# Altium project MB.PrjPCB
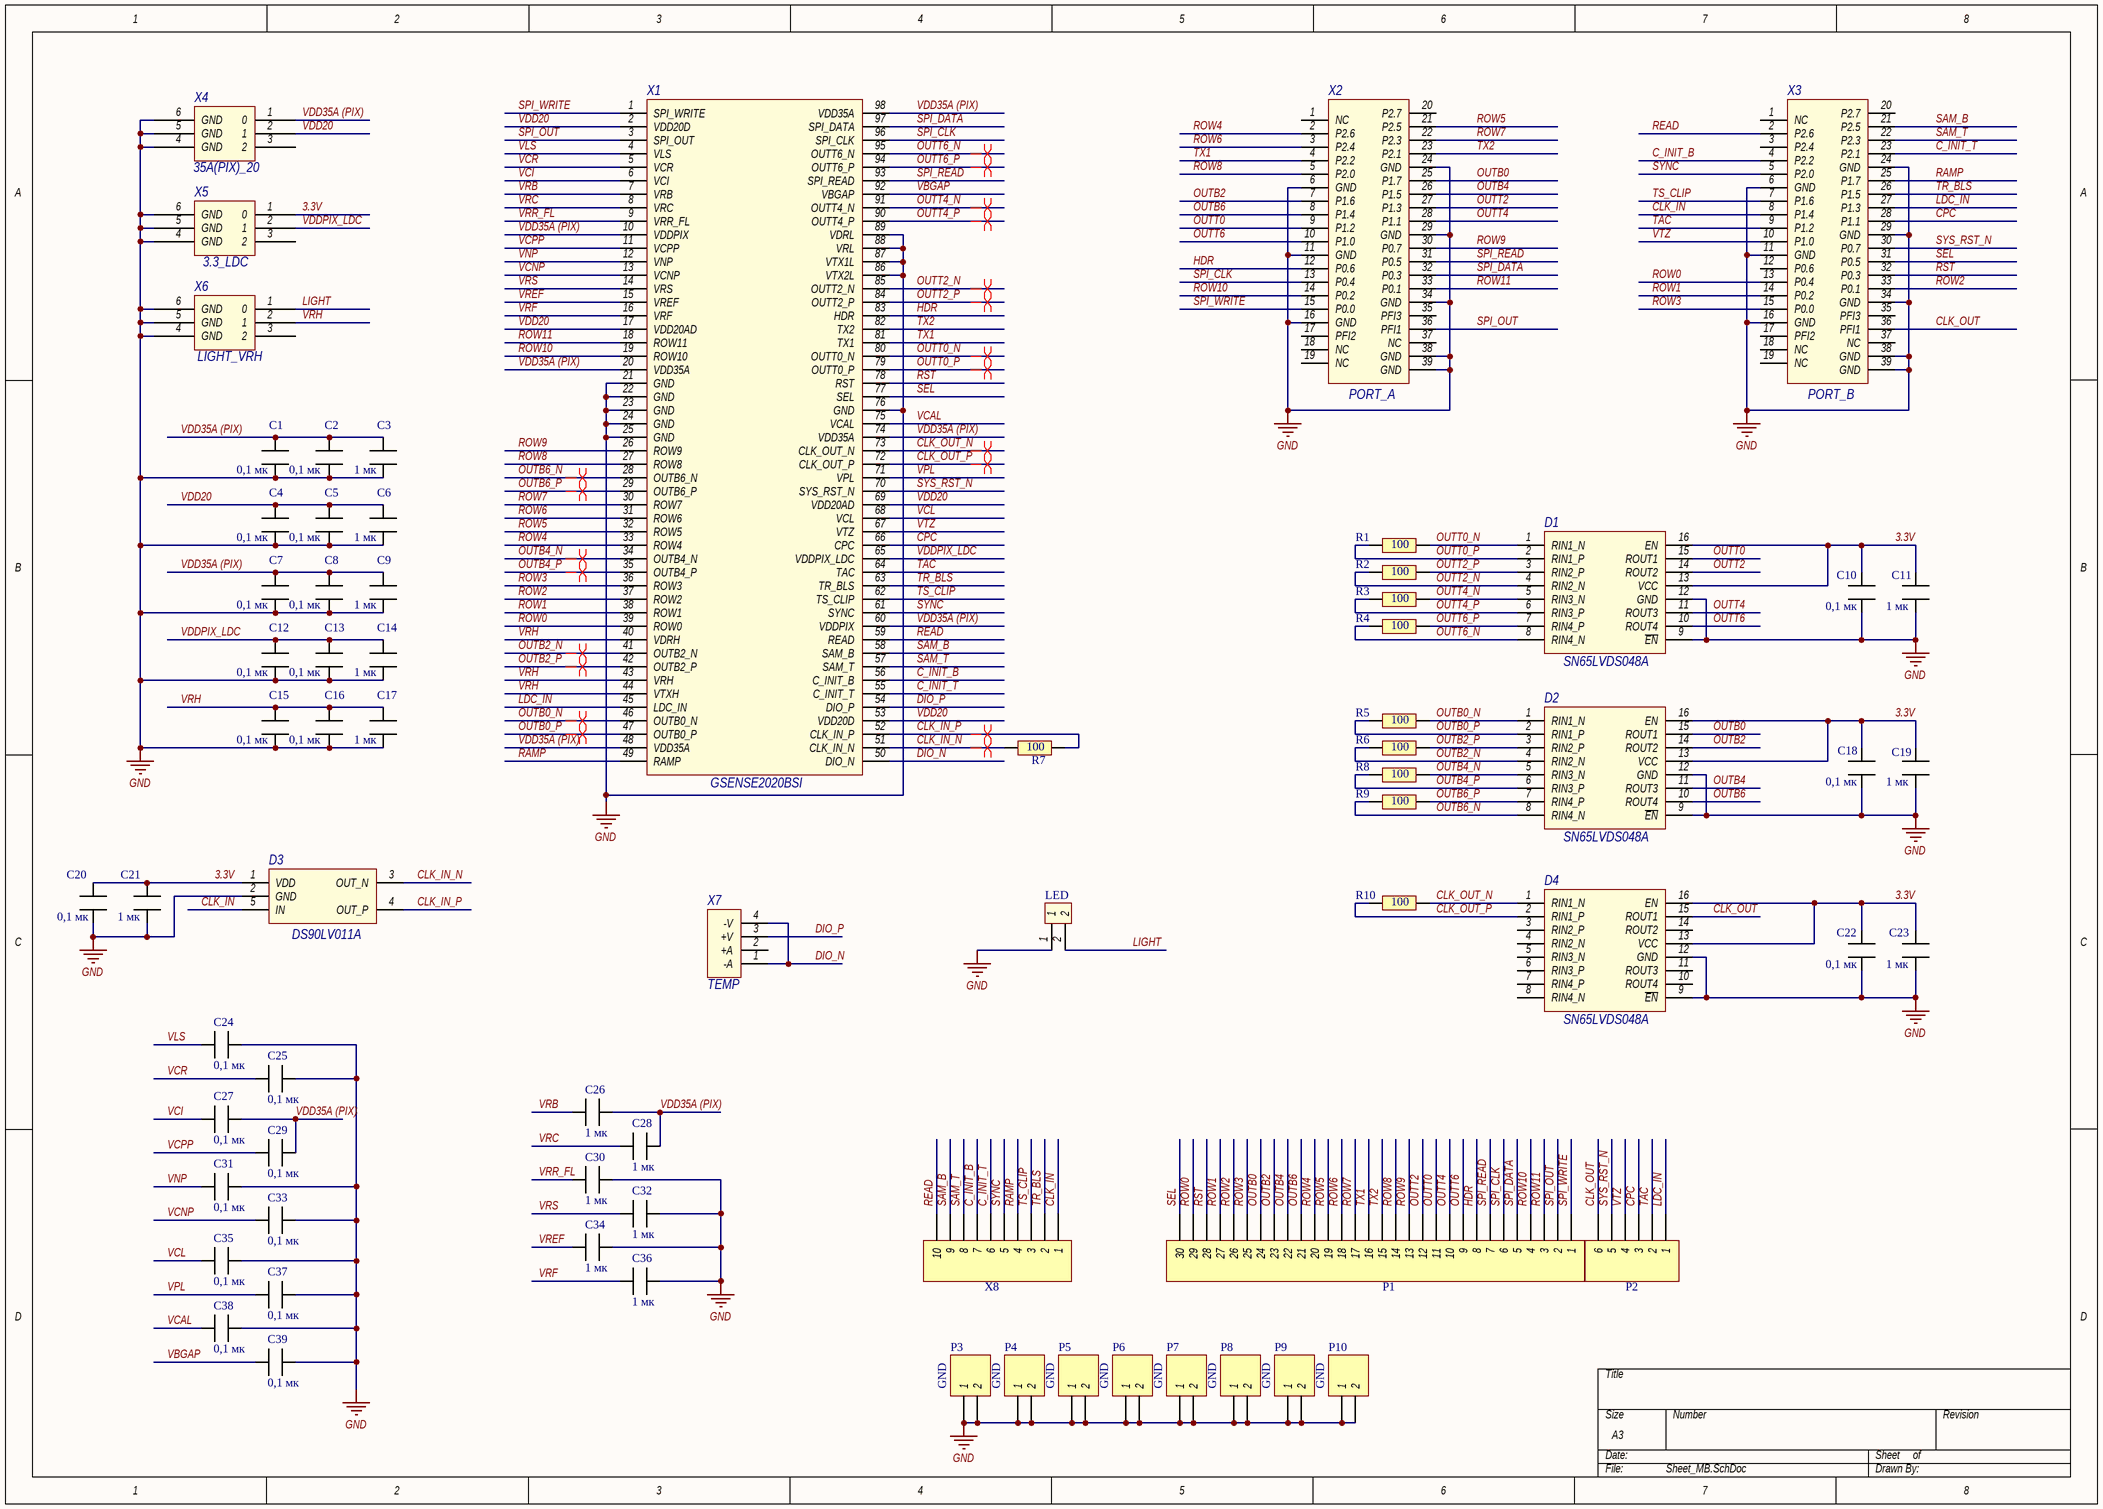
[diagram p0: Sheet_MB.SchDoc]
1 sheet, 72 parts. Net scope: global (net labels, ports and power ports of the same name join across sheets).
Board file: PCB_MB.PcbDoc

## Sheet Sheet_MB.SchDoc
size A3

### Parts
C1  0,1 мк  [CAP_SMALL]
C2  0,1 мк  [CAP_SMALL]
C3  1 мк  [CAP_SMALL]
C4  0,1 мк  [CAP_SMALL]
C5  0,1 мк  [CAP_SMALL]
C6  1 мк  [CAP_SMALL]
C7  0,1 мк  [CAP_SMALL]
C8  0,1 мк  [CAP_SMALL]
C9  1 мк  [CAP_SMALL]
C10  0,1 мк  [CAP_SMALL]
C11  1 мк  [CAP_SMALL]
C12  0,1 мк  [CAP_SMALL]
C13  0,1 мк  [CAP_SMALL]
C14  1 мк  [CAP_SMALL]
C15  0,1 мк  [CAP_SMALL]
C16  0,1 мк  [CAP_SMALL]
C17  1 мк  [CAP_SMALL]
C18  0,1 мк  [CAP_SMALL]
C19  1 мк  [CAP_SMALL]
C20  0,1 мк  [CAP_SMALL]
C21  1 мк  [CAP_SMALL]
C22  0,1 мк  [CAP_SMALL]
C23  1 мк  [CAP_SMALL]
C24  0,1 мк  [CAP_SMALL]
C25  0,1 мк  [CAP_SMALL]
C26  1 мк  [CAP_SMALL]
C27  0,1 мк  [CAP_SMALL]
C28  1 мк  [CAP_SMALL]
C29  0,1 мк  [CAP_SMALL]
C30  1 мк  [CAP_SMALL]
C31  0,1 мк  [CAP_SMALL]
C32  1 мк  [CAP_SMALL]
C33  0,1 мк  [CAP_SMALL]
C34  1 мк  [CAP_SMALL]
C35  0,1 мк  [CAP_SMALL]
C36  1 мк  [CAP_SMALL]
C37  0,1 мк  [CAP_SMALL]
C38  0,1 мк  [CAP_SMALL]
C39  0,1 мк  [CAP_SMALL]
D1  SN65LVDS048A  [SN65LVDS048A (4LVDS)]
D2  SN65LVDS048A  [SN65LVDS048A (4LVDS)]
D3  DS90LV011A  [DS90LV011A]
D4  SN65LVDS048A  [SN65LVDS048A (4LVDS)]
LED  LED  [KLEMMNIK_2]  (value not drawn)
P1  Header 30  [HDR1X30]  (value not drawn)
P2  Header 6  [HDR1X6]  (value not drawn)
P3  GND  [HDR1X2]
P4  GND  [HDR1X2]
P5  GND  [HDR1X2]
P6  GND  [HDR1X2]
P7  GND  [HDR1X2]
P8  GND  [HDR1X2]
P9  GND  [HDR1X2]
P10  GND  [HDR1X2]
R1  100  [RES]
R2  100  [RES]
R3  100  [RES]
R4  100  [RES]
R5  100  [RES]
R6  100  [RES]
R7  100  [RES]
R8  100  [RES]
R9  100  [RES]
R10  100  [RES]
X1  GSENSE2020BSI  [GSENSE2020BSI_MEZ]
X2  PORT_A  [CHEAP_CONN_FEMALE]
X3  PORT_B  [CHEAP_CONN_FEMALE]
X4  35A(PIX)_20  [POWER]
X5  3.3_LDC  [POWER]
X6  LIGHT_VRH  [POWER]
X7  TEMP  [AMP_VOLTMETER]
X8  Header 10  [HDR1X10]  (value not drawn)

### Nets
GND: C1.1 C2.1 C3.1 C4.1 C5.1 C6.1 C7.1 C8.1 C9.1 C10.1 C11.1 C12.1 C13.1 C14.1 C15.1 C16.1 C17.1 C18.1 C19.1 C20.1 C21.1 C22.1 C23.1 C24.1 C25.1 C30.1 C31.1 C32.1 C33.1 C34.1 C35.1 C36.1 C37.1 C38.1 C39.1 D1.9(~{EN}) D1.12(GND) D2.9(~{EN}) D2.12(GND) D3.2(GND) D4.9(~{EN}) D4.12(GND) LED.1 P3.1 P3.2 P4.1 P4.2 P5.1 P5.2 P6.1 P6.2 P7.1 P7.2 P8.1 P8.2 P9.1 P9.2 P10.1 P10.2 X1.21(GND) X1.22(GND) X1.23(GND) X1.24(GND) X1.25(GND) X1.76(GND) X1.86(VTX2L) X1.87(VTX1L) X1.88(VRL) X1.89(VDRL) X2.6(GND) X2.11(GND) X2.16(GND) X2.24(GND) X2.29(GND) X2.34(GND) X2.38(GND) X2.39(GND) X3.6(GND) X3.11(GND) X3.16(GND) X3.24(GND) X3.29(GND) X3.34(GND) X3.38(GND) X3.39(GND) X4.4(GND) X4.5(GND) X4.6(GND) X5.4(GND) X5.5(GND) X5.6(GND) X6.4(GND) X6.5(GND) X6.6(GND)
3.3V: C10.2 C11.2 C18.2 C19.2 C20.2 C21.2 C22.2 C23.2 D1.13(VCC) D1.16(EN) D2.13(VCC) D2.16(EN) D3.1(VDD) D4.13(VCC) D4.16(EN) X5.1(0)
C_INIT_B: X1.56(C_INIT_B) X3.4(P2.2) X8.7
C_INIT_T: X1.55(C_INIT_T) X3.23(P2.1) X8.6
CLK_IN: D3.5(IN) X3.8(P1.4) X8.1
CLK_IN_N: D3.3(OUT_N) R7.1 X1.51(CLK_IN_N)
CLK_IN_P: D3.4(OUT_P) R7.2 X1.52(CLK_IN_P)
CLK_OUT: D4.15(ROUT1) P2.6 X3.36(PFI1)
CLK_OUT_N: D4.1(RIN1_N) R10.2 X1.73(CLK_OUT_N)
CLK_OUT_P: D4.2(RIN1_P) R10.1 X1.72(CLK_OUT_P)
CPC: P2.3 X1.66(CPC) X3.28(P1.1)
DIO_N: X1.50(DIO_N) X7.1(-A) X7.4(-V)
DIO_P: X1.54(DIO_P) X7.3(+V)
HDR: P1.8 X1.83(HDR) X2.12(P0.6)
LDC_IN: P2.1 X1.45(LDC_IN) X3.27(P1.3)
LIGHT: LED.2 X6.1(0)
OUTB0: D2.15(ROUT1) P1.24 X2.25(P1.7)
OUTB0_N: D2.1(RIN1_N) R5.2 X1.46(OUTB0_N)
OUTB0_P: D2.2(RIN1_P) R5.1 X1.47(OUTB0_P)
OUTB2: D2.14(ROUT2) P1.23 X2.7(P1.6)
OUTB2_N: D2.4(RIN2_N) R6.1 X1.41(OUTB2_N)
OUTB2_P: D2.3(RIN2_P) R6.2 X1.42(OUTB2_P)
OUTB4: D2.11(ROUT3) P1.22 X2.26(P1.5)
OUTB4_N: D2.5(RIN3_N) R8.2 X1.34(OUTB4_N)
OUTB4_P: D2.6(RIN3_P) R8.1 X1.35(OUTB4_P)
OUTB6: D2.10(ROUT4) P1.21 X2.8(P1.4)
OUTB6_N: D2.8(RIN4_N) R9.1 X1.28(OUTB6_N)
OUTB6_P: D2.7(RIN4_P) R9.2 X1.29(OUTB6_P)
OUTT0: D1.15(ROUT1) P1.11 X2.9(P1.2)
OUTT0_N: D1.1(RIN1_N) R1.2 X1.80(OUTT0_N)
OUTT0_P: D1.2(RIN1_P) R1.1 X1.79(OUTT0_P)
OUTT2: D1.14(ROUT2) P1.12 X2.27(P1.3)
OUTT2_N: D1.4(RIN2_N) R2.1 X1.85(OUTT2_N)
OUTT2_P: D1.3(RIN2_P) R2.2 X1.84(OUTT2_P)
OUTT4: D1.11(ROUT3) P1.10 X2.28(P1.1)
OUTT4_N: D1.5(RIN3_N) R3.2 X1.91(OUTT4_N)
OUTT4_P: D1.6(RIN3_P) R3.1 X1.90(OUTT4_P)
OUTT6: D1.10(ROUT4) P1.9 X2.10(P1.0)
OUTT6_N: D1.8(RIN4_N) R4.1 X1.95(OUTT6_N)
OUTT6_P: D1.7(RIN4_P) R4.2 X1.94(OUTT6_P)
RAMP: X1.49(RAMP) X3.25(P1.7) X8.4
READ: X1.59(READ) X3.2(P2.6) X8.10
ROW0: P1.29 X1.39(ROW0) X3.13(P0.4)
ROW1: P1.27 X1.38(ROW1) X3.14(P0.2)
ROW2: P1.26 X1.37(ROW2) X3.33(P0.1)
ROW3: P1.25 X1.36(ROW3) X3.15(P0.0)
ROW4: P1.20 X1.33(ROW4) X2.2(P2.6)
ROW5: P1.19 X1.32(ROW5) X2.21(P2.5)
ROW6: P1.18 X1.31(ROW6) X2.3(P2.4)
ROW7: P1.17 X1.30(ROW7) X2.22(P2.3)
ROW8: P1.14 X1.27(ROW8) X2.5(P2.0)
ROW9: P1.13 X1.26(ROW9) X2.30(P0.7)
ROW10: P1.4 X1.19(ROW10) X2.14(P0.2)
ROW11: P1.3 X1.18(ROW11) X2.33(P0.1)
RST: P1.28 X1.78(RST) X3.32(P0.3)
SAM_B: X1.58(SAM_B) X3.21(P2.5) X8.9
SAM_T: X1.57(SAM_T) X3.22(P2.3) X8.8
SEL: P1.30 X1.77(SEL) X3.31(P0.5)
SPI_CLK: P1.6 X1.96(SPI_CLK) X2.13(P0.4)
SPI_DATA: P1.5 X1.97(SPI_DATA) X2.32(P0.3)
SPI_OUT: P1.2 X1.3(SPI_OUT) X2.36(PFI1)
SPI_READ: P1.7 X1.93(SPI_READ) X2.31(P0.5)
SPI_WRITE: P1.1 X1.1(SPI_WRITE) X2.15(P0.0)
SYNC: X1.61(SYNC) X3.5(P2.0) X8.5
SYS_RST_N: P2.5 X1.70(SYS_RST_N) X3.30(P0.7)
TAC: P2.2 X1.64(TAC) X3.9(P1.2)
TR_BLS: X1.63(TR_BLS) X3.26(P1.5) X8.2
TS_CLIP: X1.62(TS_CLIP) X3.7(P1.6) X8.3
TX1: P1.16 X1.81(TX1) X2.4(P2.2)
TX2: P1.15 X1.82(TX2) X2.23(P2.1)
VBGAP: C39.2 X1.92(VBGAP)
VCAL: C38.2 X1.75(VCAL)
VCI: C27.2 X1.6(VCI)
VCL: C35.2 X1.68(VCL)
VCNP: C33.2 X1.13(VCNP)
VCPP: C29.2 X1.11(VCPP)
VCR: C25.2 X1.5(VCR)
VDD20: C4.2 C5.2 C6.2 X1.2(VDD20D) X1.17(VDD20AD) X1.53(VDD20D) X1.69(VDD20AD) X4.2(1)
VDD35A (PIX): C1.2 C2.2 C3.2 C7.2 C8.2 C9.2 C26.1 C27.1 C28.1 C29.1 X1.10(VDDPIX) X1.20(VDD35A) X1.48(VDD35A) X1.60(VDDPIX) X1.74(VDD35A) X1.98(VDD35A) X4.1(0)
VDDPIX_LDC: C12.2 C13.2 C14.2 X1.65(VDDPIX_LDC) X5.2(1)
VLS: C24.2 X1.4(VLS)
VNP: C31.2 X1.12(VNP)
VPL: C37.2 X1.71(VPL)
VRB: C26.2 X1.7(VRB)
VRC: C28.2 X1.8(VRC)
VREF: C34.2 X1.15(VREF)
VRF: C36.2 X1.16(VRF)
VRH: C15.2 C16.2 C17.2 X1.40(VDRH) X1.43(VRH) X1.44(VTXH) X6.2(1)
VRR_FL: C30.2 X1.9(VRR_FL)
VRS: C32.2 X1.14(VRS)
VTZ: P2.4 X1.67(VTZ) X3.10(P1.0)

Not connected (* = marked no-connect by the designer): D4 3(RIN2_P) 4(RIN2_N) 5(RIN3_N) 6(RIN3_P) 7(RIN4_P) 8(RIN4_N) 10(ROUT4) 11(ROUT3) 14(ROUT2); X2 1(NC) 17(PFI2) 18(NC) 19(NC) 20(P2.7) 35(PFI3) 37(NC); X3 1(NC) 3(P2.4) 12(P0.6) 17(PFI2) 18(NC) 19(NC) 20(P2.7) 35(PFI3) 37(NC); X4 3(2); X5 3(2); X6 3(2); X7 2(+A)

### Layout directives
differential pair: CLK_IN_N, CLK_IN_P, CLK_OUT_N, CLK_OUT_P, OUTB0_N, OUTB0_P, OUTB2_N, OUTB2_P, OUTB4_N, OUTB4_P, OUTB6_N, OUTB6_P, OUTT0_N, OUTT0_P, OUTT2_N, OUTT2_P, OUTT4_N, OUTT4_P, OUTT6_N, OUTT6_P

### Library data of the parts
C1-C39 = CAP_SMALL
D1 D2 D4 = SN65LVDS048A (4LVDS)
D3 = DS90LV011A: LVDS Driver 1 ch
LED = KLEMMNIK_2
P1 = Header 30: Header, 30-Pin; LatestRevisionDate: 17-Jul-2002; LatestRevisionNote: Re-released for DXP Platform.; Publisher: Altium Limited
P2 = Header 6: Header, 6-Pin; LatestRevisionDate: 17-Jul-2002; LatestRevisionNote: Re-released for DXP Platform.; Publisher: Altium Limited
P3-P10 = Header 2: Header, 2-Pin; LatestRevisionDate: 17-Jul-2002; LatestRevisionNote: Re-released for DXP Platform.; Publisher: Altium Limited
R1-R10 = RES
X1 = GSENSE2020BSI_MEZ
X2 X3 = CHEAP_CON_37_FEMALE
X4-X6 = POWER
X7 = AMP_VOLTMETER
X8 = Header 10: Header, 10-Pin; LatestRevisionDate: 17-Jul-2002; LatestRevisionNote: Re-released for DXP Platform.; Publisher: Altium Limited